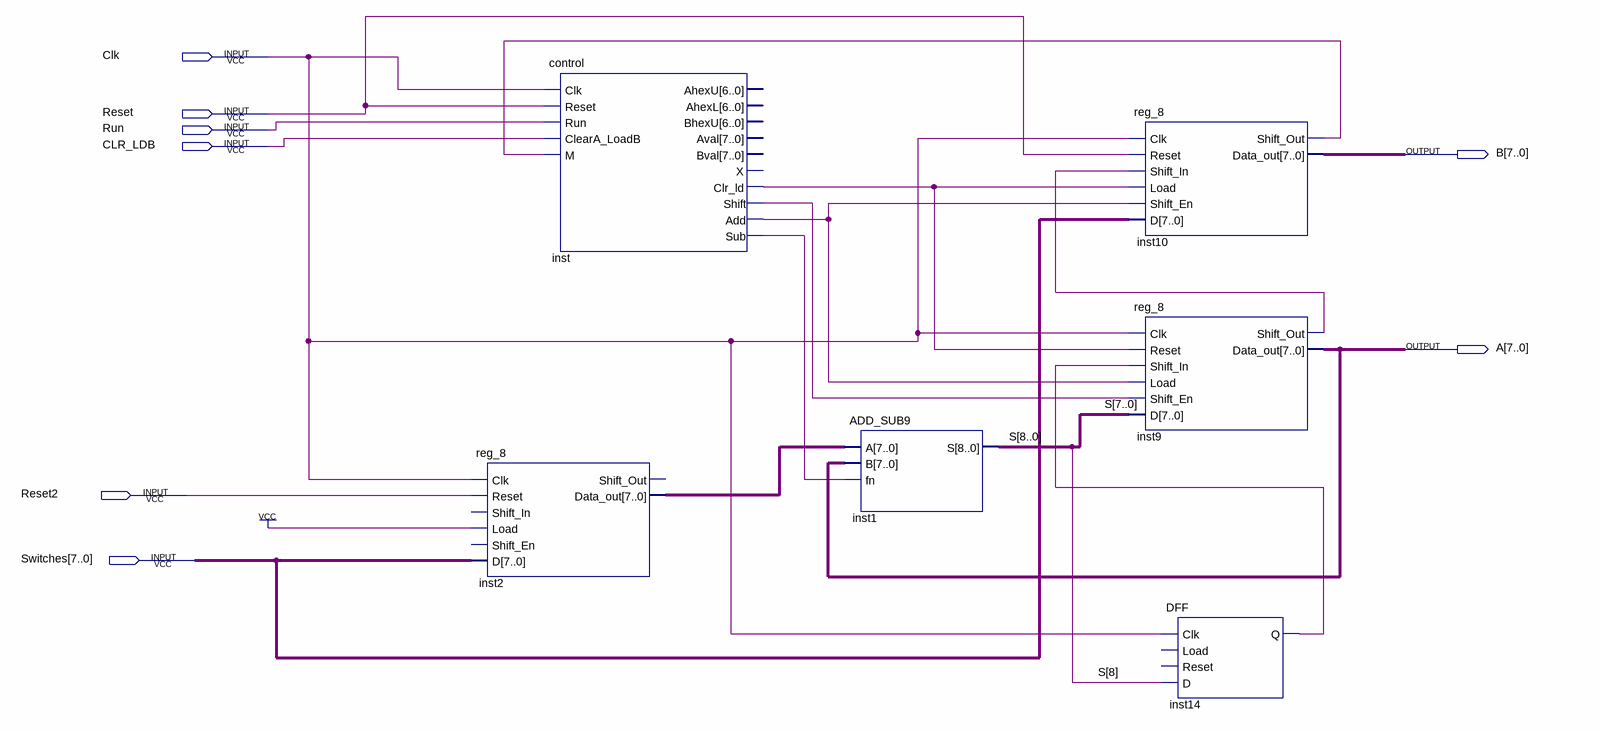
[diagram p0: schematic sheet]
// Quartus schematic 8bitmult.bdf as structural Verilog: 6 symbols, 8 pins
module \8bitmult  (
  input  Clk,
  input  Reset,
  input  Run,
  input  CLR_LDB,
  input  Reset2,
  input  [7:0] Switches,
  output [7:0] B,
  output [7:0] A
);

  wire inst9_shift_out, inst10_shift_out, inst14_q, inst_add, inst_clr_ld, inst_shift, inst_sub;
  wire [7:0] inst2_data_out;
  wire [8:0] S;

  reg_8 inst2 (
    .Clk(Clk), .Reset(Reset2), .Load(1'b1), .D(Switches), .Data_out(inst2_data_out));  // open: Shift_In, Shift_En, Shift_Out
  control inst (
    .Clk(Clk), .Reset(Reset), .Run(Run), .ClearA_LoadB(CLR_LDB), .M(inst10_shift_out), .Clr_ld(inst_clr_ld),
    .Shift(inst_shift), .Add(inst_add), .Sub(inst_sub));  // open: AhexU, AhexL, BhexU, Aval, Bval, X
  ADD_SUB9 inst1 (.A(inst2_data_out), .B(A), .fn(inst_sub), .S(S));
  reg_8 inst10 (
    .Clk(Clk), .Reset(Reset), .Shift_In(inst9_shift_out), .Load(inst_clr_ld), .Shift_En(inst_add),
    .D(Switches), .Shift_Out(inst10_shift_out), .Data_out(B));
  reg_8 inst9 (
    .Clk(Clk), .Reset(inst_clr_ld), .Shift_In(inst14_q), .Load(inst_add), .Shift_En(inst_shift), .D(S[7:0]),
    .Shift_Out(inst9_shift_out), .Data_out(A));
  DFF inst14 (.Clk(Clk), .D(S[8]), .Q(inst14_q));  // open: Load, Reset
endmodule
